# Altium schematic sheet Sheet1.SchDoc
size A4; SheetNumber: 1; SheetTotal: 6
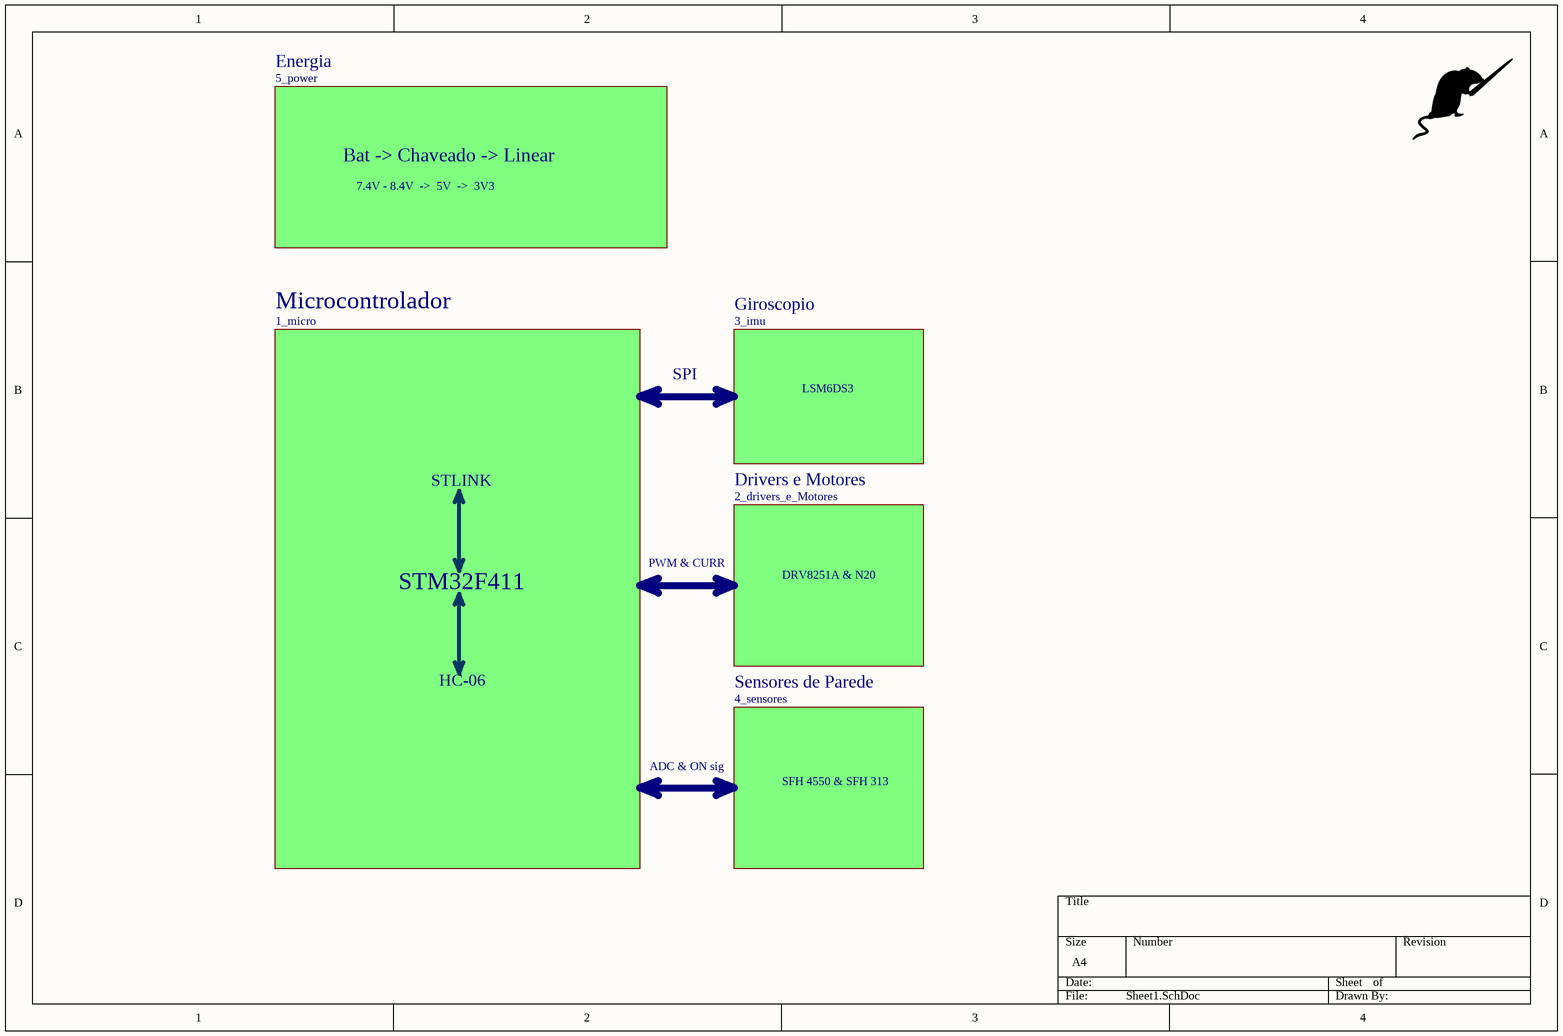
[diagram p0: Sheet1.SchDoc]

## Sub-sheets
Drivers e Motores = 2_drivers_e_Motores: no entries
Energia = 5_power: no entries
Giroscopio = 3_imu: no entries
Microcontrolador = 1_micro: no entries
Sensores de Parede = 4_sensores: no entries

## Notes on the sheet
- Bat -> Chaveado -> Linear
- 7.4V - 8.4V  ->  5V  ->  3V3
- SPI
- LSM6DS3
- STLINK
- PWM & CURR
- DRV8251A & N20
- STM32F411
- HC-06
- ADC & ON sig
- SFH 4550 & SFH 313